# EAGLE design DEC8L-buscon (EAGLE 6.6.0)
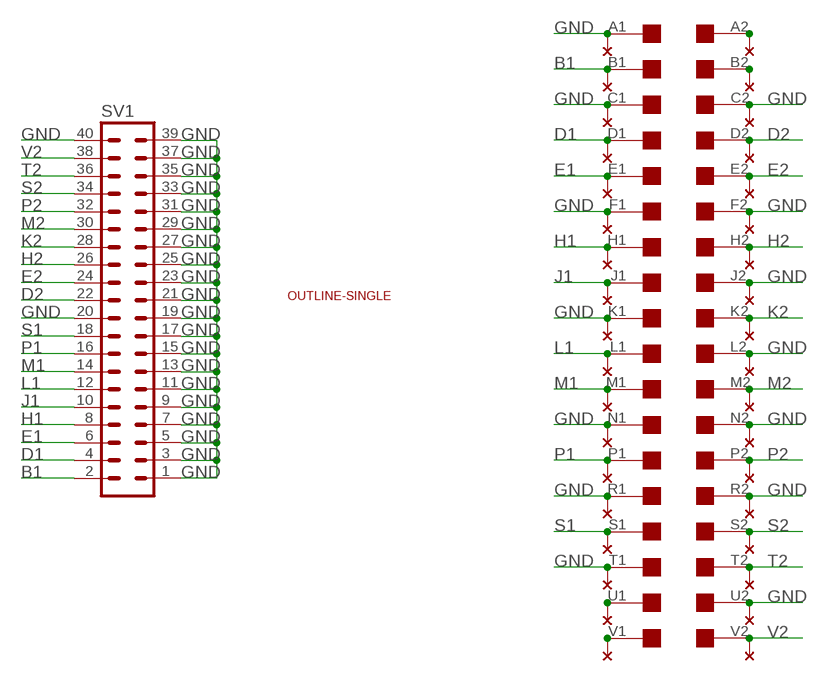
[diagram p0: schematic, sheet 1]

## Parts
EDGE1  EDGE-2CONNECTOR  [EDGE-CON2]
SV1  MA20-2  [MA20-2]
U$4  OUTLINE-SINGLE  [SINGLE]
U$5  THRU-HOLE2  [THRU-HOLEB]

## Nets
B1: EDGE1.B1 SV1.2 U$5.B1
D1: EDGE1.D1 SV1.4 U$5.D1
D2: EDGE1.D2 SV1.22 U$5.D2
E1: EDGE1.E1 SV1.6 U$5.E1
E2: EDGE1.E2 SV1.24 U$5.E2
GND: EDGE1.A1 EDGE1.C1 EDGE1.C2 EDGE1.F1 EDGE1.F2 EDGE1.J2 EDGE1.K1 EDGE1.L2 EDGE1.N1 EDGE1.N2 EDGE1.R1 EDGE1.R2 EDGE1.T1 EDGE1.U2 SV1.1 SV1.3 SV1.5 SV1.7 SV1.9 SV1.11 SV1.13 SV1.15 SV1.17 SV1.19 SV1.20 SV1.21 SV1.23 SV1.25 SV1.27 SV1.29 SV1.31 SV1.33 SV1.35 SV1.37 SV1.39 SV1.40 U$5.A1 U$5.C1 U$5.C2 U$5.F1 U$5.F2 U$5.J2 U$5.K1 U$5.L2 U$5.N1 U$5.N2 U$5.R1 U$5.R2 U$5.T1 U$5.U2
H1: EDGE1.H1 SV1.8 U$5.H1
H2: EDGE1.H2 SV1.26 U$5.H2
J1: EDGE1.J1 SV1.10 U$5.J1
K2: EDGE1.K2 SV1.28 U$5.K2
L1: EDGE1.L1 SV1.12 U$5.L1
M1: EDGE1.M1 SV1.14 U$5.M1
M2: EDGE1.M2 SV1.30 U$5.M2
N$1: EDGE1.B2 U$5.B2
N$2: EDGE1.A2 U$5.A2
N$3: EDGE1.U1 U$5.U1
N$4: EDGE1.V1 U$5.V1
P1: EDGE1.P1 SV1.16 U$5.P1
P2: EDGE1.P2 SV1.32 U$5.P2
S1: EDGE1.S1 SV1.18 U$5.S1
S2: EDGE1.S2 SV1.34 U$5.S2
T2: EDGE1.T2 SV1.36 U$5.T2
V2: EDGE1.V2 SV1.38 U$5.V2

## Library data of the parts
EDGE1 = dec-con:EDGE-2: Double-Sided DEC edge connector.
SV1 = con-lstb:MA20-2: PIN HEADER; OC_FARNELL: unknown; OC_NEWARK: unknown
U$4 = dec-con:OUTLINE-*: Board outlines for DEC boards.
U$5 = dec-con:THRU-HOLE2: Thru-Hole addition to double-sided edge connector.

## Board
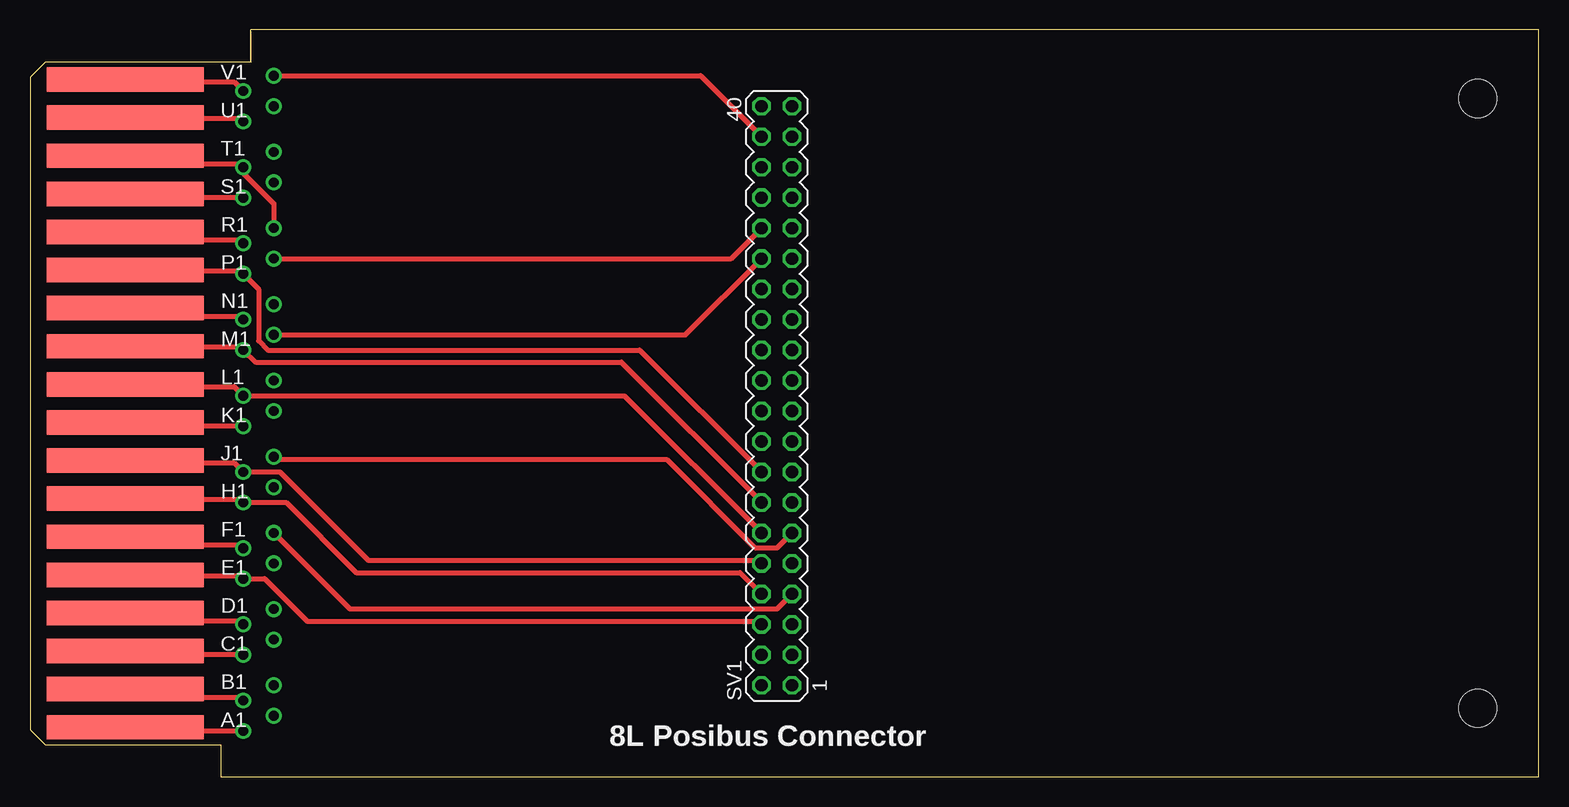
[diagram p1: board, top side]
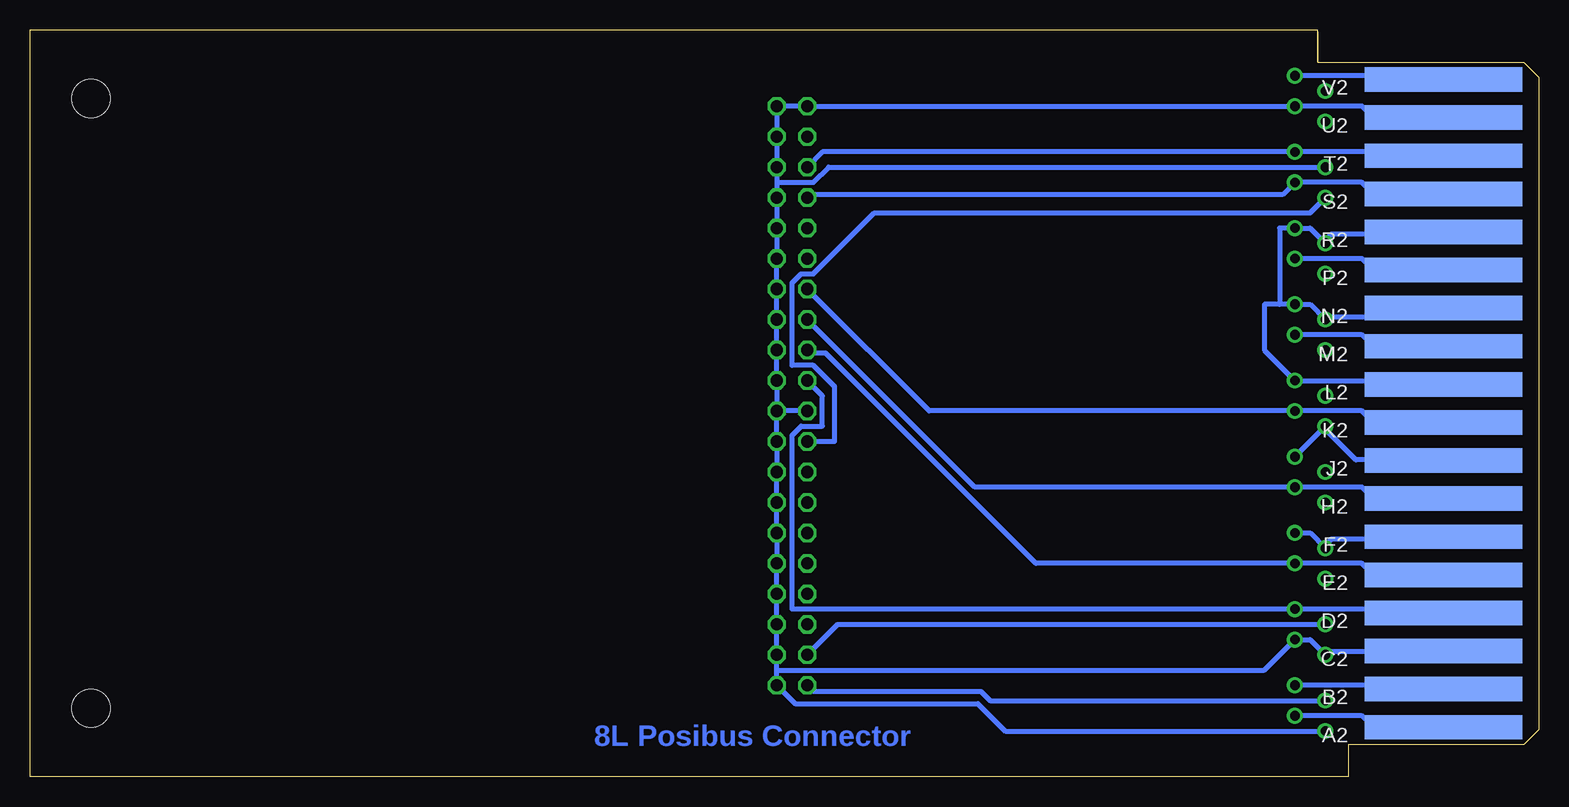
[diagram p2: board, bottom side, seen from below]

Size 125.73 x 62.23 mm. Coordinates in mm from the lower left corner, seen from the top.
Copper layers (1+16): Top 0.035mm / dielectric 1.5mm / Bottom 0.035mm
Design rules "16mils": minimum track width 16mil, minimum drill 32mil, track to track 15mil, track to pad 10mil, pad to pad 10mil, via to via 10mil, smd to smd 10mil, copper to edge 13mil, drill to drill 10mil, minimum pad ring 10mil, minimum via ring 8mil, stop-mask expansion 0mil, vias tented up to drill 0mil, thermal gap 10mil

### Footprints (pad centres in the part's own frame; a part is rotated, then mirrored left to right if it is on the bottom)
EDGE-CON2 = smd 13.106 x 2.032: A1 7.938,4.128; B1 7.938,7.303; C1 7.938,10.477; D1 7.938,13.652; E1 7.938,16.828; F1 7.938,20.003; H1 7.938,23.177; J1 7.938,26.352; K1 7.938,29.527; L1 7.938,32.703; M1 7.938,35.877; N1 7.938,39.053; P1 7.938,42.227; R1 7.938,45.403; S1 7.938,48.578; T1 7.938,51.752; U1 7.938,54.928; V1 7.938,58.102 | smd 13.106 x 2.032 bottom: A2 7.938,4.128; B2 7.938,7.303; C2 7.938,10.477; D2 7.938,13.652; E2 7.938,16.828; F2 7.938,20.003; H2 7.938,23.177; J2 7.938,26.352; K2 7.938,29.527; L2 7.938,32.703; M2 7.938,35.877; N2 7.938,39.053; P2 7.938,42.227; R2 7.938,45.403; S2 7.938,48.578; T2 7.938,51.752; U2 7.938,54.928; V2 7.938,58.102
MA20-2 = drill 1.016 octagon: 1 -24.13,-1.27; 2 -24.13,1.27; 3 -21.59,-1.27; 4 -21.59,1.27; 5 -19.05,-1.27; 6 -19.05,1.27; 7 -16.51,-1.27; 8 -16.51,1.27; 9 -13.97,-1.27; 10 -13.97,1.27; 11 -11.43,-1.27; 12 -11.43,1.27; 13 -8.89,-1.27; 14 -8.89,1.27; 15 -6.35,-1.27; 16 -6.35,1.27; 17 -3.81,-1.27; 18 -3.81,1.27; 19 -1.27,-1.27; 20 -1.27,1.27; 21 1.27,-1.27; 22 1.27,1.27; 23 3.81,-1.27; 24 3.81,1.27; 25 6.35,-1.27; 26 6.35,1.27; 27 8.89,-1.27; 28 8.89,1.27; 29 11.43,-1.27; 30 11.43,1.27; 31 13.97,-1.27; 32 13.97,1.27; 33 16.51,-1.27; 34 16.51,1.27; 35 19.05,-1.27; 36 19.05,1.27; 37 21.59,-1.27; 38 21.59,1.27; 39 24.13,-1.27; 40 24.13,1.27
SINGLE = hole 3.175: 120.65,56.515; 120.65,5.715
THRU-HOLEB = drill 0.813 pad 1.27: A1 17.78,3.81; A2 20.32,5.08; B1 17.78,6.35; B2 20.32,7.62; C1 17.78,10.16; C2 20.32,11.43; D1 17.78,12.7; D2 20.32,13.97; E1 17.78,16.51; E2 20.32,17.78; F1 17.78,19.05; F2 20.32,20.32; H1 17.78,22.86; H2 20.32,24.13; J1 17.78,25.4; J2 20.32,26.67; K1 17.78,29.21; K2 20.32,30.48; L1 17.78,31.75; L2 20.32,33.02; M1 17.78,35.56; M2 20.32,36.83; N1 17.78,38.1; N2 20.32,39.37; P1 17.78,41.91; P2 20.32,43.18; R1 17.78,44.45; R2 20.32,45.72; S1 17.78,48.26; S2 20.32,49.53; T1 17.78,50.8; T2 20.32,52.07; U1 17.78,54.61; U2 20.32,55.88; V1 17.78,57.15; V2 20.32,58.42

### Placement (x,y rotation side)
EDGE1  0,0 0 top
SV1  62.23,31.75 90 top
U$4  0,0 0 top
U$5  0,0 0 top

### Tracks (layer width: path | path; a pad name or v marks a point on that pad's centre or on a via)
B1
  Top 0.406: EDGE1.B1 8.64,6.6 17.53,6.6 U$5.B1
  Bottom 0.406: U$5.B1 45.72,6.35 46.48,7.11 60.45,7.11 SV1.2
D1
  Top 0.406: EDGE1.D1 8.64,12.95 17.53,12.95 U$5.D1
  Bottom 0.406: U$5.D1 58.42,12.7 SV1.4
D2
  Bottom 0.406: EDGE1.D2 8.13,13.72 8.38,13.97 U$5.D2 62.23,13.97 62.23,28.45 61.47,29.21 59.69,29.21 59.69,31.75 SV1.22
E1
  Top 0.406: EDGE1.E1 8.13,16.76 17.53,16.76 U$5.E1 19.56,16.51 23.11,12.95 60.71,12.95 SV1.6
E2
  Bottom 0.406: EDGE1.E2 8.13,17.02 13.97,17.02 14.73,17.78 U$5.E2 41.91,17.78 59.44,35.31 60.71,35.31 SV1.24
GND
  Top 0.406: EDGE1.N1 8.64,38.35 17.53,38.35 U$5.N1 | EDGE1.R1 8.64,44.7 17.53,44.7 U$5.R1 | U$5.K1 8.38,29.21 8.13,29.46 EDGE1.K1 | EDGE1.F1 8.64,19.3 17.53,19.3 U$5.F1 | U$5.C1 8.38,10.16 8.13,10.41 EDGE1.C1 | U$5.A1 8.38,3.81 8.13,4.06 EDGE1.A1 | EDGE1.T1 8.64,51.05 17.53,51.05 U$5.T1 17.78,50.29 20.32,47.75 U$5.R2 | U$5.F2 26.67,13.97 62.23,13.97 SV1.7 | U$5.J2 20.57,26.42 53.09,26.42 60.45,19.05 62.23,19.05 SV1.11
  Bottom 0.406: 63.5,49.53 SV1.35 SV1.37 SV1.39 SV1.40 U$5.U2 14.73,55.88 13.97,55.12 8.13,55.12 EDGE1.U2 | 63.5,49.53 SV1.33 SV1.31 SV1.29 SV1.27 SV1.25 SV1.23 SV1.21 SV1.19 | SV1.20 SV1.19 | SV1.19 SV1.17 SV1.15 SV1.13 SV1.11 SV1.9 SV1.7 SV1.5 SV1.3 63.5,8.89 | 63.5,8.89 SV1.1 61.98,6.1 46.74,6.1 44.45,3.81 U$5.A1 | 21.59,39.37 U$5.N2 19.05,39.37 U$5.N1 17.78,38.35 8.64,38.35 EDGE1.N1 | 21.59,39.37 22.86,39.37 22.86,35.56 U$5.L2 8.38,33.02 8.13,32.77 EDGE1.L2 | EDGE1.R1 8.13,45.21 17.27,45.21 17.78,44.7 U$5.R1 19.05,45.72 U$5.R2 21.59,45.72 21.59,39.37 | U$5.J2 U$5.K1 17.78,28.96 15.24,26.42 8.13,26.42 EDGE1.J2 | U$5.F2 19.05,20.32 U$5.F1 17.78,19.3 17.27,19.81 8.13,19.81 EDGE1.F1 | EDGE1.C1 8.13,10.41 17.78,10.41 U$5.C1 19.05,11.43 U$5.C2 22.86,8.89 63.5,8.89 | U$5.T1 59.18,50.8 60.45,49.53 63.5,49.53
H1
  Top 0.406: EDGE1.H1 8.13,23.11 17.53,23.11 U$5.H1 21.34,22.86 27.18,17.02 59.18,17.02 SV1.8
  Bottom 0.406: 60.45,15.49 SV1.8
H2
  Bottom 0.406: EDGE1.H2 8.13,23.37 13.97,23.37 14.73,24.13 U$5.H2 46.99,24.13 SV1.26
J1
  Top 0.406: EDGE1.J1 8.13,26.16 17.02,26.16 U$5.J1 20.83,25.4 28.19,18.03 60.71,18.03 SV1.10
K2
  Bottom 0.406: EDGE1.K2 8.13,29.72 13.97,29.72 14.73,30.48 U$5.K2 50.8,30.48 SV1.28
L1
  Top 0.406: EDGE1.L1 8.13,32.51 17.02,32.51 U$5.L1 49.53,31.75 SV1.12
M1
  Top 0.406: EDGE1.M1 8.13,35.81 17.53,35.81 U$5.M1 18.8,34.54 49.28,34.54 SV1.14
M2
  Top 0.406: SV1.30 54.61,36.83 U$5.M2
  Bottom 0.406: U$5.M2 14.73,36.83 13.97,36.07 8.13,36.07 EDGE1.M2
N$1
  Bottom 0.406: U$5.B2 8.38,7.62 8.13,7.37 EDGE1.B2
N$2
  Bottom 0.406: U$5.A2 14.73,5.08 13.97,4.32 8.13,4.32 EDGE1.A2
N$3
  Top 0.406: U$5.U1 17.53,54.86 8.13,54.86 EDGE1.U1
N$4
  Top 0.406: U$5.V1 17.02,57.91 8.13,57.91 EDGE1.V1
P1
  Top 0.406: EDGE1.P1 8.13,42.16 17.53,42.16 U$5.P1 19.05,40.64 19.05,36.32 19.81,35.56 50.8,35.56 SV1.16
P2
  Top 0.406: SV1.32 58.42,43.18 U$5.P2
  Bottom 0.406: U$5.P2 14.73,43.18 13.97,42.42 8.13,42.42 EDGE1.P2
S1
  Top 0.406: U$5.S1 8.38,48.26 8.13,48.51 EDGE1.S1
  Bottom 0.406: U$5.S1 19.05,46.99 55.37,46.99 60.45,41.91 61.47,41.91 62.23,41.15 62.23,34.29 60.45,34.29 58.67,32.51 58.67,27.94 SV1.18
S2
  Bottom 0.406: EDGE1.S2 8.13,48.77 13.97,48.77 14.73,49.53 U$5.S2 21.34,48.51 60.71,48.51 SV1.34
T2
  Bottom 0.406: EDGE1.T2 8.13,51.82 8.38,52.07 U$5.T2 59.69,52.07 SV1.36
V2
  Top 0.406: SV1.38 55.88,58.42 U$5.V2
  Bottom 0.406: U$5.V2 8.38,58.42 8.13,58.17 EDGE1.V2

### Text on the board
Bottom: 8L Posibus Connector
tPlace: 8L Posibus Connector